# Altium schematic sheet Top.SchDoc
size A4; SheetNumber: 1; SheetTotal: 5
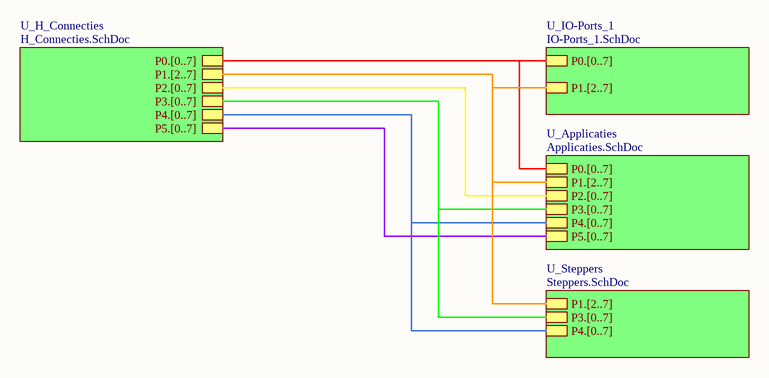
[diagram p0: Top.SchDoc]

## Sub-sheets
U_Applicaties = Applicaties.SchDoc: P5.[0..7], P2.[0..7], P4.[0..7], P3.[0..7], P1.[2..7], P0.[0..7]
U_H_Connecties = H_Connecties.SchDoc: P0.[0..7], P2.[0..7], P4.[0..7], P3.[0..7], P5.[0..7], P1.[2..7]
U_IO-Ports_1 = IO-Ports_1.SchDoc: P0.[0..7], P1.[2..7]
U_Steppers = Steppers.SchDoc: P1.[2..7], P4.[0..7], P3.[0..7]

## Buses and harness runs
bus sheet U_Applicaties/P0.[0..7] = sheet U_H_Connecties/P0.[0..7] = sheet U_IO-Ports_1/P0.[0..7]
bus sheet U_Applicaties/P1.[2..7] = sheet U_H_Connecties/P1.[2..7] = sheet U_IO-Ports_1/P1.[2..7] = sheet U_Steppers/P1.[2..7]
bus sheet U_Applicaties/P2.[0..7] = sheet U_H_Connecties/P2.[0..7]
bus sheet U_Applicaties/P3.[0..7] = sheet U_H_Connecties/P3.[0..7] = sheet U_Steppers/P3.[0..7]
bus sheet U_Applicaties/P4.[0..7] = sheet U_H_Connecties/P4.[0..7] = sheet U_Steppers/P4.[0..7]
bus sheet U_Applicaties/P5.[0..7] = sheet U_H_Connecties/P5.[0..7]